# Altium schematic sheet Driver.SchDoc
size A4; SheetNumber: 3; SheetTotal: 3
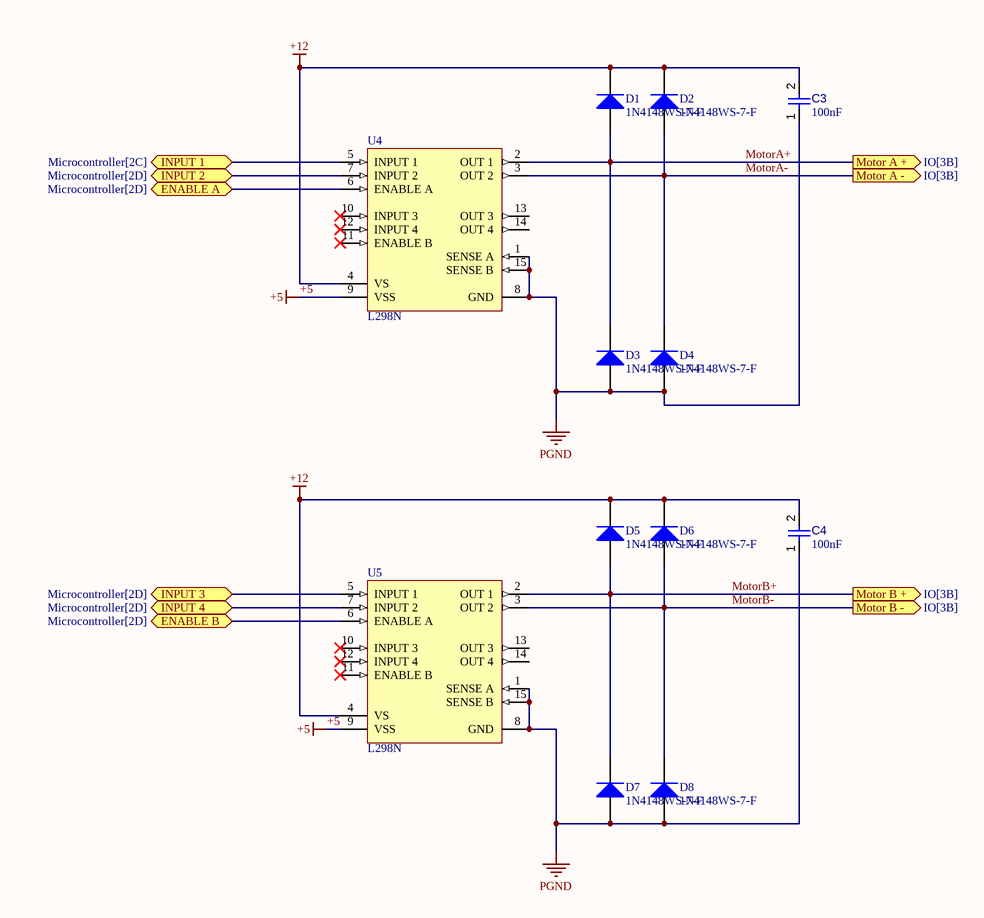
[diagram p0: Driver.SchDoc]

## Parts
C3  value 100nF  [CAPC1608X90X40NL10T20]  (hidden comment: Capacitor 100 nF +/-10% 50 V 0603)
C4  value 100nF  [CAPC1608X90X40NL10T20]  (hidden comment: Capacitor 100 nF +/-10% 50 V 0603)
D1  1N4148WS-7-F  [DIOD-SOD323-2-A_V]
D2  1N4148WS-7-F  [DIOD-SOD323-2-A_V]
D3  1N4148WS-7-F  [DIOD-SOD323-2-A_V]
D4  1N4148WS-7-F  [DIOD-SOD323-2-A_V]
D5  1N4148WS-7-F  [DIOD-SOD323-2-A_V]
D6  1N4148WS-7-F  [DIOD-SOD323-2-A_V]
D7  1N4148WS-7-F  [DIOD-SOD323-2-A_V]
D8  1N4148WS-7-F  [DIOD-SOD323-2-A_V]
U4  L298N  [STM-FM-15]
U5  L298N  [STM-FM-15]

## Ports
ENABLE A (bidir, see Microcontroller[2D]), ENABLE B (bidir, see Microcontroller[2D]), INPUT 1 (bidir, see Microcontroller[2C]), INPUT 2 (bidir, see Microcontroller[2D]), INPUT 3 (bidir, see Microcontroller[2D]), INPUT 4 (bidir, see Microcontroller[2D]), Motor A + (out, see IO[3B]), Motor A - (out, see IO[3B]), Motor B + (out, see IO[3B]), Motor B - (out, see IO[3B])

## Nets
+5: U4.9(VSS) U5.9(VSS)
+12: C3.2 C4.2 D1.2(K) D2.2(K) D5.2(K) D6.2(K) U4.4(VS) U5.4(VS)
PGND: C3.1 C4.1 D3.1(A) D4.1(A) D7.1(A) D8.1(A) U4.1(SENSE_A) U4.8(GND) U4.15(SENSE_B) U5.1(SENSE_A) U5.8(GND) U5.15(SENSE_B)
ENABLE A: U4.6(ENABLE_A) ; port ENABLE A
ENABLE B: U5.6(ENABLE_A) ; port ENABLE B
INPUT 1: U4.5(INPUT_1) ; port INPUT 1
INPUT 2: U4.7(INPUT_2) ; port INPUT 2
INPUT 3: U5.5(INPUT_1) ; port INPUT 3
INPUT 4: U5.7(INPUT_2) ; port INPUT 4
MotorA+: D1.1(A) D3.2(K) U4.2(OUT_1) ; port Motor A +
MotorA-: D2.1(A) D4.2(K) U4.3(OUT_2) ; port Motor A -
MotorB+: D5.1(A) D7.2(K) U5.2(OUT_1) ; port Motor B +
MotorB-: D6.1(A) D8.2(K) U5.3(OUT_2) ; port Motor B -

Not connected (* = marked no-connect by the designer): U4 10(INPUT_3)* 11(ENABLE_B)* 12(INPUT_4)* 13(OUT_3) 14(OUT_4); U5 10(INPUT_3)* 11(ENABLE_B)* 12(INPUT_4)* 13(OUT_3) 14(OUT_4)

## Library data of the parts
C3 C4 = CMP-001-00017-6: Chip Capacitor, 100 nF, +/- 10%, 50 V, 0603 (1608 Metric); Voltage Rating: 50V; Capacitor Type: Ceramic; Tolerance: 10%; Mounting Technology: SM; Max Operating Temperature: 125°C; RoHS Compliant: True; Pins: 2; Case/Package: 0603; Min Operating Temperature: -55°C
D1-D8 = CMP-1667-00004-1: Fast Switching Diode, 75 V, 0.3 A, -65 to 150 degC, 2-Pin SOD323, RoHS, Tape and Reel; DatasheetVersion: Rev. 25-2, 03/2016; PackageDescription: 2-Pin Small Outline Diode, Body 1.7 x 1.3 mm; ComponentLink2Description: Datasheet; ComponentLink1URL: http://www.diodes.com/; PackageReference: SOD323-2; ComponentLink2URL: http://www.diodes.com/datasheets/ds30097.pdf; ComponentLink1Description: Manufacturer URL
U4 U5 = CMP-2000-06526-1: Dual Full-Bridge Driver, 4.8 to 46 V, -40 to 150 degC, 15-Pin FM (MW 15L), RoHS, Tube; Manufacturer: STMicroelectronics; PartNumber: L298; Output Current: 2A; Supply Voltage Max: 7V; Driver Case Style: Multiwatt; Supply Voltage Min: 4.5V; No. of Pins: 15Pins; SVHC: NoSVHC(17-Dec-2015); Output Voltage: 46V; No. of Outputs: 4Outputs; Motor Type: FullBridge; MSL: -; Package Description: 15-Pin Flange Mount, Body 5 x 19.6 mm, Pitch 1.27 mm; Datasheet Version: 01/2000; Package Reference: FM-15; Mounting Technology: ThroughHole; Packaging: Each; Automotive Qualification Standard: -; Product Range: -; Datasheet URL: https://datasheet.ciiva.com/15109/getdatasheetpartid-50682-15109332.pdf; Operating Temperature Max: 130°C; Operating Temperature Min: -25°C; Manufacturer URL: http://www.st.com/